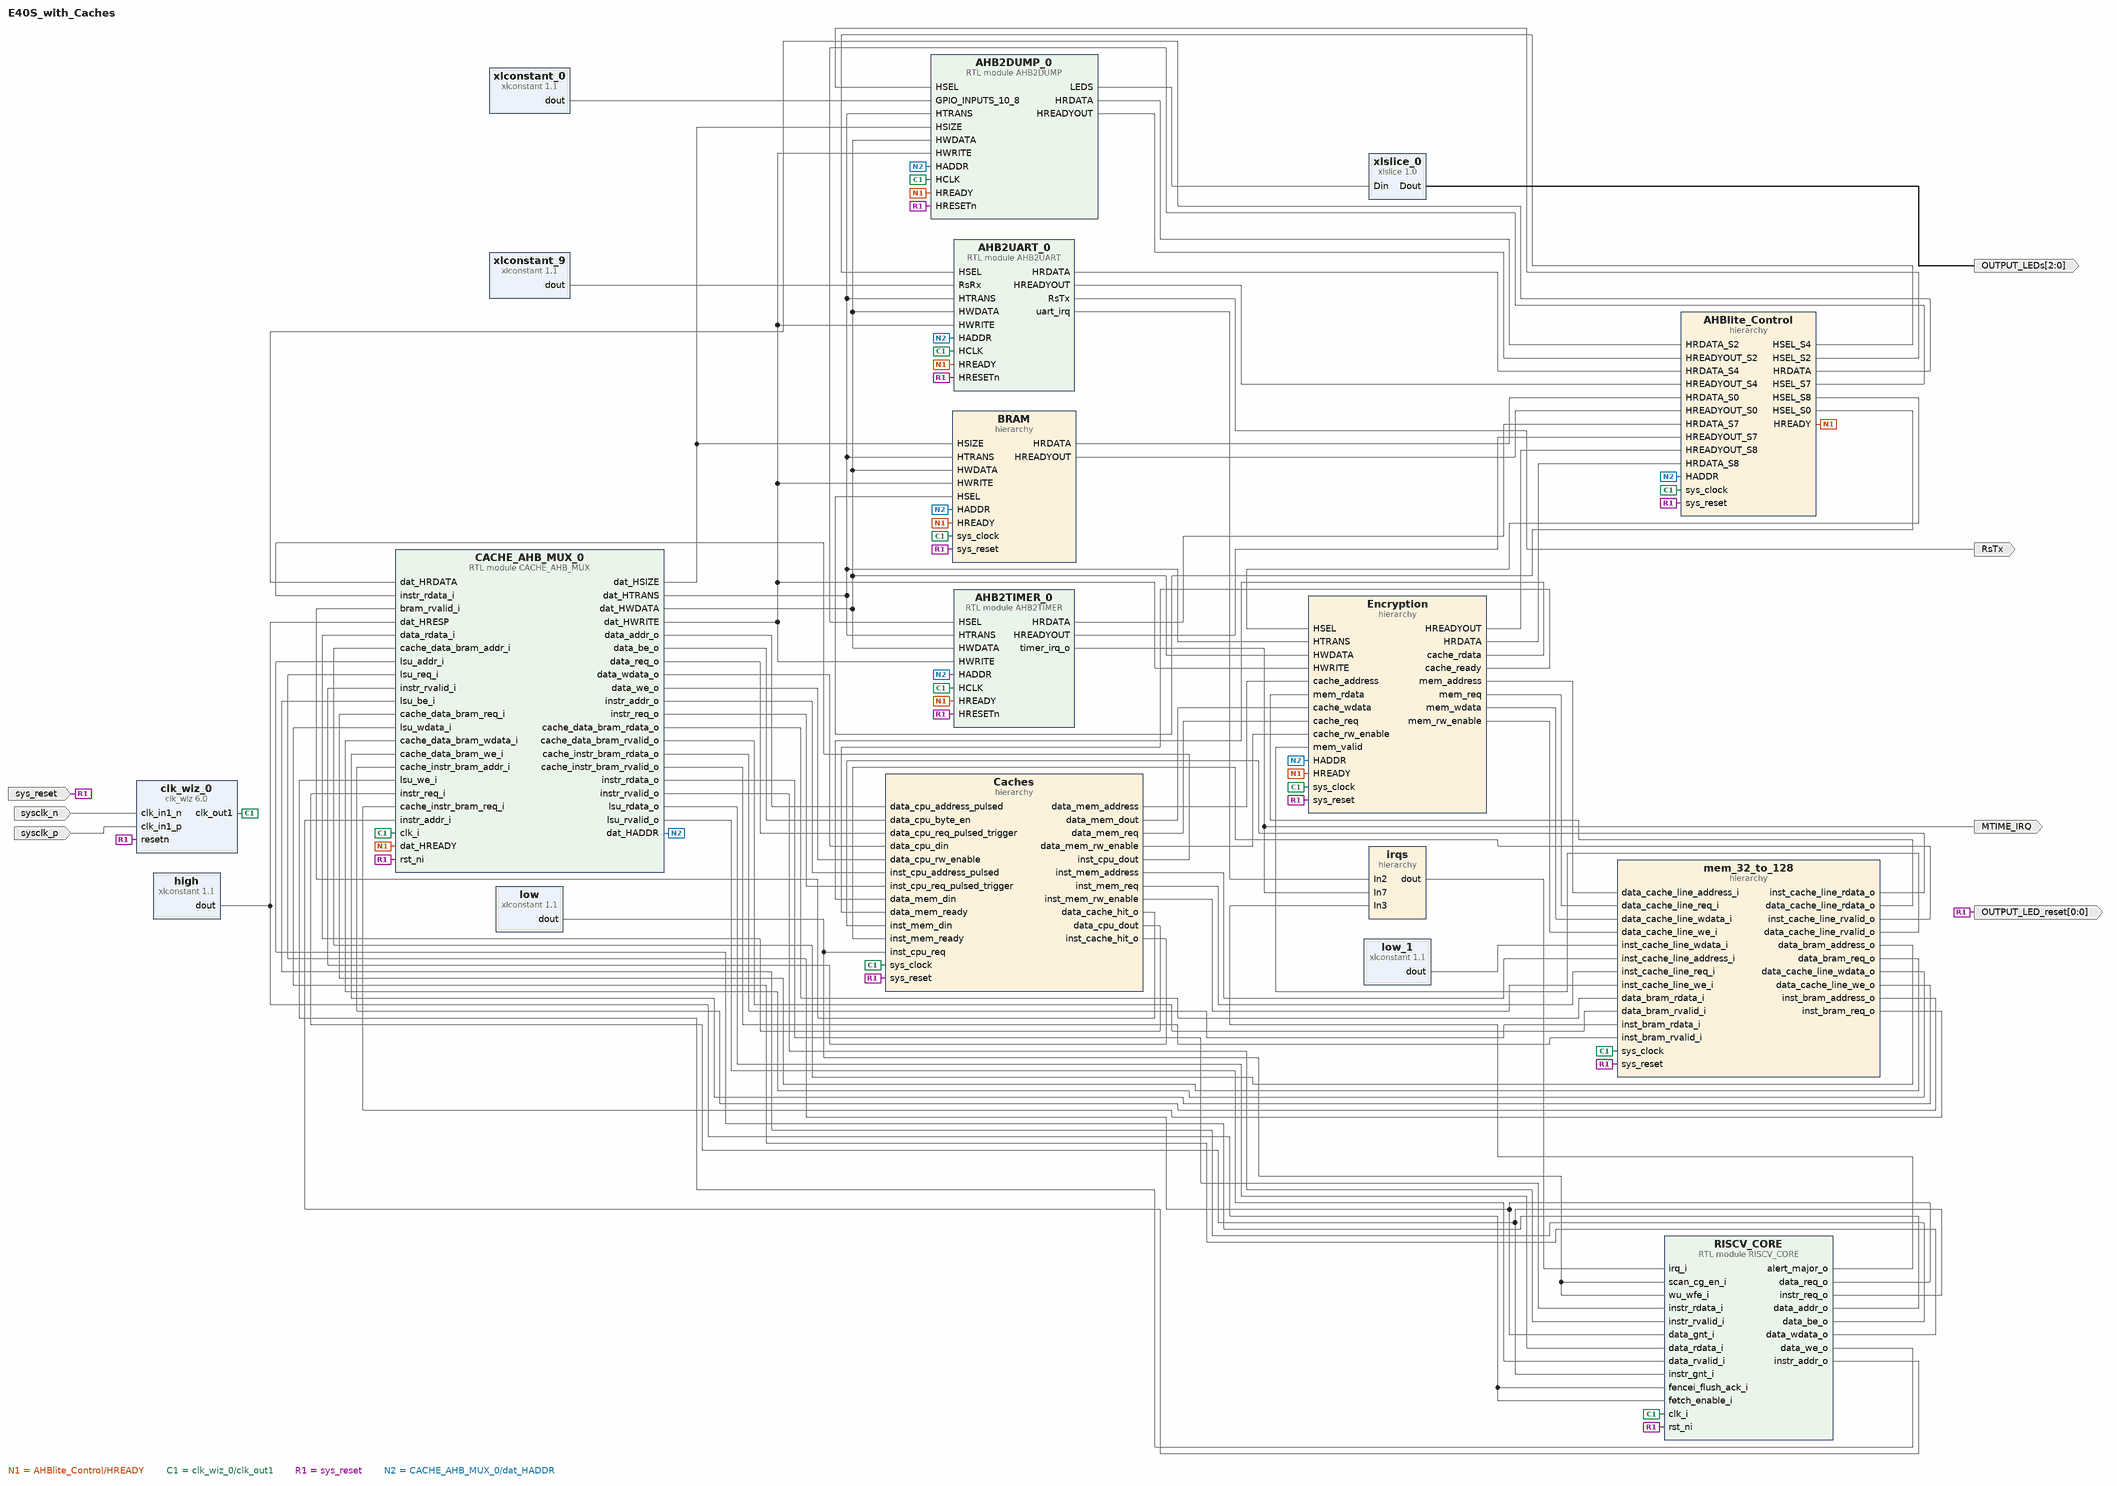
[diagram p0: block diagram of the top level]
# Vivado block design E40S_with_Caches, xc7k325tffg900-2, Vivado 2024.2
create_bd_design E40S_with_Caches

create_bd_port -dir O -from 2 -to 0 OUTPUT_LEDs
create_bd_port -dir O -from 0 -to 0 OUTPUT_LED_reset
create_bd_port -dir I sys_reset
create_bd_port -dir I sysclk_p
create_bd_port -dir I sysclk_n
create_bd_port -dir O RsTx
create_bd_port -dir O MTIME_IRQ

create_bd_cell -type ip -vlnv xilinx.com:ip:xlslice:1.0 xlslice_0
set_property -dict {CONFIG.DIN_FROM 2 CONFIG.DIN_WIDTH 8 CONFIG.DOUT_WIDTH 3} [get_bd_cells xlslice_0]
create_bd_cell -type hier BRAM
create_bd_cell -type hier irqs
create_bd_cell -type hier Caches
create_bd_cell -type hier AHBlite_Control
create_bd_cell -type module -reference AHB2TIMER AHB2TIMER_0
create_bd_cell -type module -reference AHB2UART AHB2UART_0
create_bd_cell -type module -reference CACHE_AHB_MUX CACHE_AHB_MUX_0
set_property -dict {CONFIG.MEMORY_END_ADDRESS 0x80FFFFFF CONFIG.MEMORY_START_ADDRESS 0x80000000} [get_bd_cells CACHE_AHB_MUX_0]
create_bd_cell -type module -reference RISCV_CORE RISCV_CORE
set_property -dict {CONFIG.BOOT_ADDRESS 0x80010000 CONFIG.PMP_NUM_REGIONS 16} [get_bd_cells RISCV_CORE]
create_bd_cell -type hier mem_32_to_128
create_bd_cell -type hier Encryption
create_bd_cell -type module -reference AHB2DUMP AHB2DUMP_0
create_bd_cell -type ip -vlnv xilinx.com:ip:xlconstant:1.1 high
create_bd_cell -type ip -vlnv xilinx.com:ip:xlconstant:1.1 low
set_property -dict {CONFIG.CONST_VAL 0} [get_bd_cells low]
create_bd_cell -type ip -vlnv xilinx.com:ip:xlconstant:1.1 low_1
set_property -dict {CONFIG.CONST_VAL 0 CONFIG.CONST_WIDTH 128} [get_bd_cells low_1]
create_bd_cell -type ip -vlnv xilinx.com:ip:xlconstant:1.1 xlconstant_0
set_property -dict {CONFIG.CONST_WIDTH 3} [get_bd_cells xlconstant_0]
create_bd_cell -type ip -vlnv xilinx.com:ip:xlconstant:1.1 xlconstant_9
set_property -dict {CONFIG.CONST_VAL 0 CONFIG.CONST_WIDTH 1} [get_bd_cells xlconstant_9]
create_bd_cell -type ip -vlnv xilinx.com:ip:clk_wiz:6.0 clk_wiz_0
set_property -dict [list \
  CONFIG.CLKIN1_JITTER_PS 50.0 \
  CONFIG.CLKIN2_JITTER_PS 166.66 \
  CONFIG.CLKOUT1_DRIVES BUFG \
  CONFIG.CLKOUT1_JITTER 155.788 \
  CONFIG.CLKOUT1_PHASE_ERROR 94.329 \
  CONFIG.CLKOUT1_REQUESTED_OUT_FREQ 20.000 \
  CONFIG.CLKOUT2_DRIVES BUFG \
  CONFIG.CLKOUT3_DRIVES BUFG \
  CONFIG.CLKOUT4_DRIVES BUFG \
  CONFIG.CLKOUT5_DRIVES BUFG \
  CONFIG.CLKOUT6_DRIVES BUFG \
  CONFIG.CLKOUT7_DRIVES BUFG \
  CONFIG.FEEDBACK_SOURCE FDBK_AUTO \
  CONFIG.MMCM_BANDWIDTH OPTIMIZED \
  CONFIG.MMCM_CLKFBOUT_MULT_F 4.250 \
  CONFIG.MMCM_CLKIN1_PERIOD 5.000 \
  CONFIG.MMCM_CLKIN2_PERIOD 10.0 \
  CONFIG.MMCM_CLKOUT0_DIVIDE_F 42.500 \
  CONFIG.MMCM_COMPENSATION ZHOLD \
  CONFIG.PRIMITIVE MMCM \
  CONFIG.PRIM_IN_FREQ 200.000 \
  CONFIG.PRIM_SOURCE Differential_clock_capable_pin \
  CONFIG.RESET_PORT resetn \
  CONFIG.RESET_TYPE ACTIVE_LOW \
  CONFIG.SECONDARY_IN_FREQ 100.000 \
  CONFIG.SECONDARY_SOURCE Single_ended_clock_capable_pin \
  CONFIG.USE_INCLK_SWITCHOVER false \
] [get_bd_cells clk_wiz_0]

# ---- hierarchy /BRAM ----
current_bd_instance /BRAM
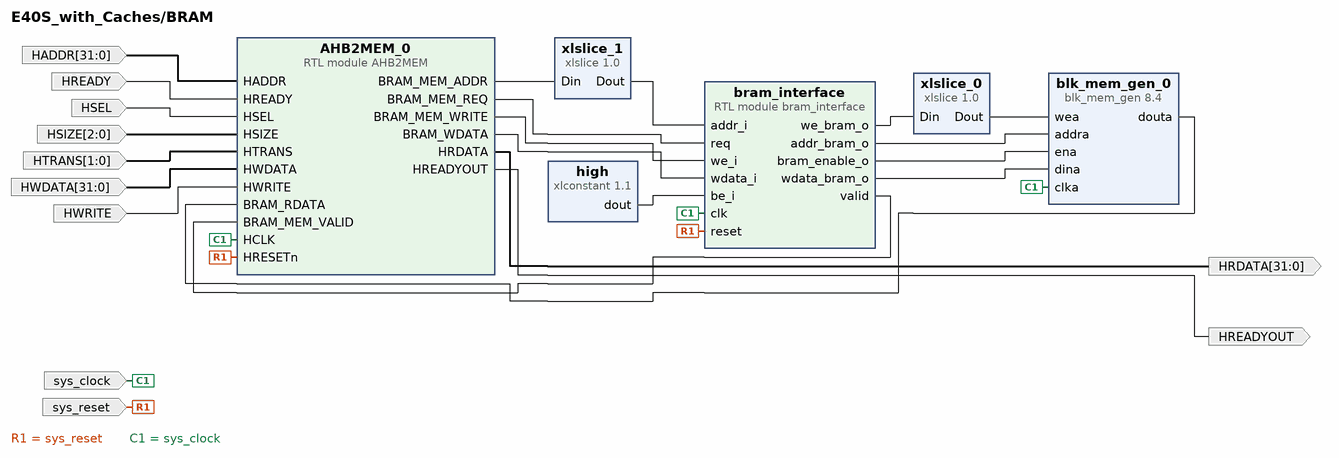
[diagram p1: block diagram inside /BRAM]
create_bd_pin -dir I sys_clock
create_bd_pin -dir I sys_reset
create_bd_pin -dir I HREADY
create_bd_pin -dir I -from 31 -to 0 HADDR
create_bd_pin -dir I HWRITE
create_bd_pin -dir I -from 31 -to 0 HWDATA
create_bd_pin -dir I -from 1 -to 0 HTRANS
create_bd_pin -dir I -from 2 -to 0 HSIZE
create_bd_pin -dir O HREADYOUT
create_bd_pin -dir I HSEL
create_bd_pin -dir O -from 31 -to 0 HRDATA

create_bd_cell -type ip -vlnv xilinx.com:ip:xlslice:1.0 xlslice_1
set_property -dict {CONFIG.DIN_FROM 19 CONFIG.DIN_TO 2 CONFIG.DOUT_WIDTH 18} [get_bd_cells xlslice_1]
create_bd_cell -type module -reference AHB2MEM AHB2MEM_0
create_bd_cell -type module -reference bram_interface bram_interface
set_property -dict {CONFIG.LATENCY_IN_CYCLES 1} [get_bd_cells bram_interface]
create_bd_cell -type ip -vlnv xilinx.com:ip:blk_mem_gen:8.4 blk_mem_gen_0
set_property -dict [list \
  CONFIG.Coe_File /home/clarmann/Documents/coe-files/fpga_demo_2_tasks.coe \
  CONFIG.Enable_32bit_Address false \
  CONFIG.Load_Init_File true \
  CONFIG.Memory_Type Single_Port_RAM \
  CONFIG.Port_B_Clock 0 \
  CONFIG.Port_B_Enable_Rate 0 \
  CONFIG.Port_B_Write_Rate 0 \
  CONFIG.Register_PortA_Output_of_Memory_Primitives true \
  CONFIG.Use_RSTA_Pin false \
  CONFIG.Write_Depth_A 132000 \
  CONFIG.Write_Width_A 32 \
  CONFIG.use_bram_block Stand_Alone \
] [get_bd_cells blk_mem_gen_0]
create_bd_cell -type ip -vlnv xilinx.com:ip:xlconstant:1.1 high
set_property -dict {CONFIG.CONST_VAL 0xf CONFIG.CONST_WIDTH 4} [get_bd_cells high]
create_bd_cell -type ip -vlnv xilinx.com:ip:xlslice:1.0 xlslice_0
set_property -dict {CONFIG.DIN_FROM 0 CONFIG.DIN_WIDTH 4 CONFIG.DOUT_WIDTH 1} [get_bd_cells xlslice_0]

# ---- hierarchy /irqs ----
current_bd_instance /irqs
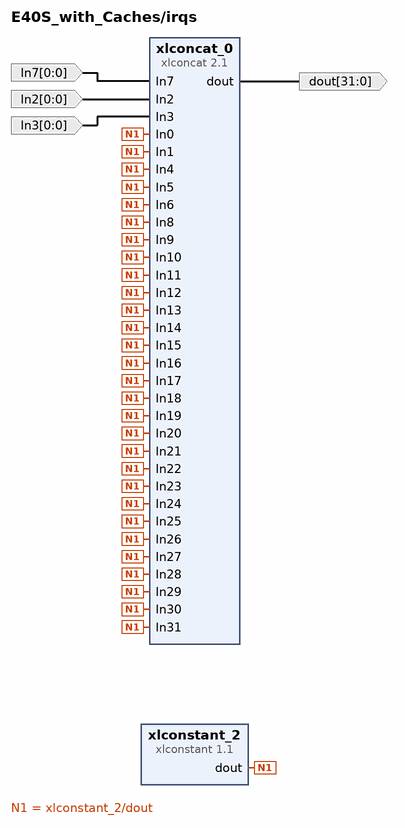
[diagram p2: block diagram inside /irqs]
create_bd_pin -dir I -from 0 -to 0 In2
create_bd_pin -dir I -from 0 -to 0 In7
create_bd_pin -dir O -from 31 -to 0 dout
create_bd_pin -dir I -from 0 -to 0 In3

create_bd_cell -type ip -vlnv xilinx.com:ip:xlconcat:2.1 xlconcat_0
set_property -dict [list \
  CONFIG.IN0_WIDTH 1 \
  CONFIG.IN10_WIDTH 1 \
  CONFIG.IN11_WIDTH 1 \
  CONFIG.IN12_WIDTH 1 \
  CONFIG.IN13_WIDTH 1 \
  CONFIG.IN14_WIDTH 1 \
  CONFIG.IN15_WIDTH 1 \
  CONFIG.IN16_WIDTH 1 \
  CONFIG.IN17_WIDTH 1 \
  CONFIG.IN18_WIDTH 1 \
  CONFIG.IN19_WIDTH 1 \
  CONFIG.IN1_WIDTH 1 \
  CONFIG.IN20_WIDTH 1 \
  CONFIG.IN21_WIDTH 1 \
  CONFIG.IN22_WIDTH 1 \
  CONFIG.IN23_WIDTH 1 \
  CONFIG.IN24_WIDTH 1 \
  CONFIG.IN25_WIDTH 1 \
  CONFIG.IN26_WIDTH 1 \
  CONFIG.IN27_WIDTH 1 \
  CONFIG.IN28_WIDTH 1 \
  CONFIG.IN29_WIDTH 1 \
  CONFIG.IN2_WIDTH 1 \
  CONFIG.IN30_WIDTH 1 \
  CONFIG.IN31_WIDTH 1 \
  CONFIG.IN3_WIDTH 1 \
  CONFIG.IN4_WIDTH 1 \
  CONFIG.IN5_WIDTH 1 \
  CONFIG.IN6_WIDTH 1 \
  CONFIG.IN7_WIDTH 1 \
  CONFIG.IN8_WIDTH 1 \
  CONFIG.IN9_WIDTH 1 \
  CONFIG.NUM_PORTS 32 \
  CONFIG.dout_width 32 \
] [get_bd_cells xlconcat_0]
create_bd_cell -type ip -vlnv xilinx.com:ip:xlconstant:1.1 xlconstant_2
set_property -dict {CONFIG.CONST_VAL 0 CONFIG.CONST_WIDTH 1} [get_bd_cells xlconstant_2]

# ---- hierarchy /Caches ----
current_bd_instance /Caches
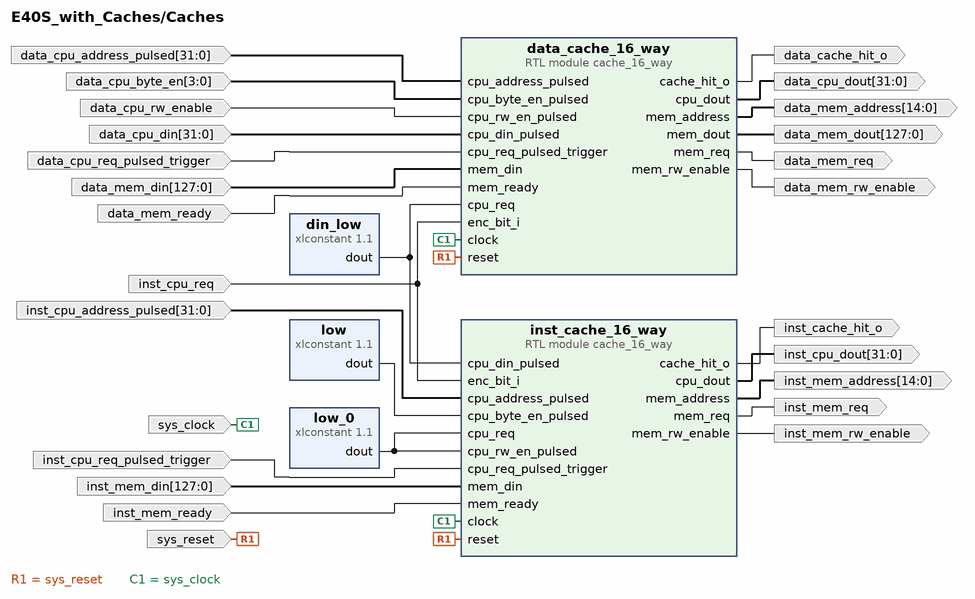
[diagram p3: block diagram inside /Caches]
create_bd_pin -dir I sys_clock
create_bd_pin -dir I sys_reset
create_bd_pin -dir I -from 31 -to 0 inst_cpu_address_pulsed
create_bd_pin -dir O -from 31 -to 0 inst_cpu_dout
create_bd_pin -dir I inst_cpu_req_pulsed_trigger
create_bd_pin -dir I inst_cpu_req
create_bd_pin -dir O inst_cache_hit_o
create_bd_pin -dir I -from 31 -to 0 data_cpu_address_pulsed
create_bd_pin -dir I -from 31 -to 0 data_cpu_din
create_bd_pin -dir O -from 31 -to 0 data_cpu_dout
create_bd_pin -dir I data_cpu_req_pulsed_trigger
create_bd_pin -dir I data_cpu_rw_enable
create_bd_pin -dir O data_cache_hit_o
create_bd_pin -dir I -from 3 -to 0 data_cpu_byte_en
create_bd_pin -dir I -from 127 -to 0 inst_mem_din
create_bd_pin -dir O -from 14 -to 0 inst_mem_address
create_bd_pin -dir O inst_mem_req
create_bd_pin -dir O inst_mem_rw_enable
create_bd_pin -dir I inst_mem_ready
create_bd_pin -dir I -from 127 -to 0 data_mem_din
create_bd_pin -dir O -from 127 -to 0 data_mem_dout
create_bd_pin -dir O -from 14 -to 0 data_mem_address
create_bd_pin -dir O data_mem_req
create_bd_pin -dir O data_mem_rw_enable
create_bd_pin -dir I data_mem_ready

create_bd_cell -type module -reference cache_16_way inst_cache_16_way
set_property -dict {CONFIG.CACHE_SIZE 8 CONFIG.WAYS 4} [get_bd_cells inst_cache_16_way]
create_bd_cell -type module -reference cache_16_way data_cache_16_way
set_property -dict {CONFIG.CACHE_SIZE 8 CONFIG.WAYS 4} [get_bd_cells data_cache_16_way]
create_bd_cell -type ip -vlnv xilinx.com:ip:xlconstant:1.1 din_low
set_property -dict {CONFIG.CONST_VAL 0 CONFIG.CONST_WIDTH 32} [get_bd_cells din_low]
create_bd_cell -type ip -vlnv xilinx.com:ip:xlconstant:1.1 low
set_property -dict {CONFIG.CONST_VAL 0 CONFIG.CONST_WIDTH 4} [get_bd_cells low]
create_bd_cell -type ip -vlnv xilinx.com:ip:xlconstant:1.1 low_0
set_property -dict {CONFIG.CONST_VAL 0 CONFIG.CONST_WIDTH 1} [get_bd_cells low_0]

# ---- hierarchy /AHBlite_Control ----
current_bd_instance /AHBlite_Control
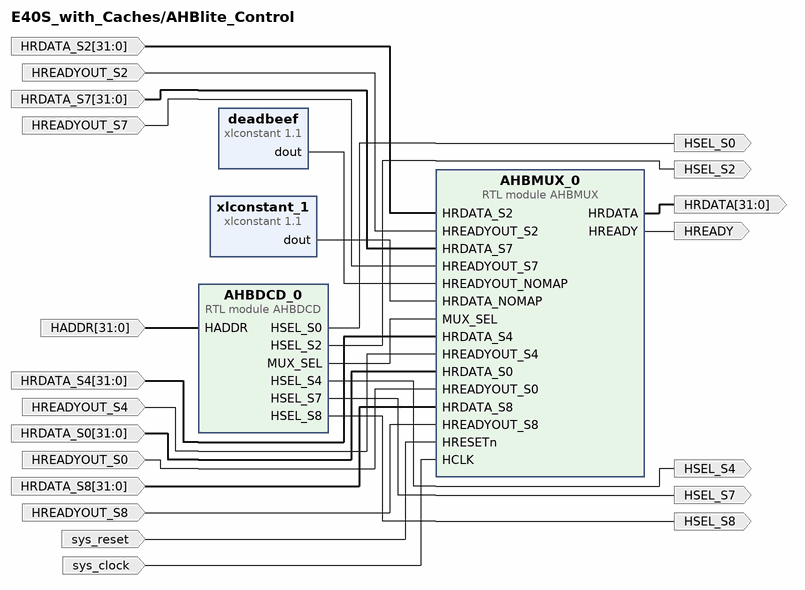
[diagram p4: block diagram inside /AHBlite_Control]
create_bd_pin -dir I sys_clock
create_bd_pin -dir I sys_reset
create_bd_pin -dir I -from 31 -to 0 HRDATA_S0
create_bd_pin -dir I -from 31 -to 0 HRDATA_S2
create_bd_pin -dir I -from 31 -to 0 HRDATA_S4
create_bd_pin -dir I -from 31 -to 0 HRDATA_S7
create_bd_pin -dir I HREADYOUT_S0
create_bd_pin -dir I HREADYOUT_S2
create_bd_pin -dir I HREADYOUT_S4
create_bd_pin -dir I HREADYOUT_S7
create_bd_pin -dir O HREADY
create_bd_pin -dir O -from 31 -to 0 HRDATA
create_bd_pin -dir I -from 31 -to 0 HADDR
create_bd_pin -dir O HSEL_S0
create_bd_pin -dir O HSEL_S2
create_bd_pin -dir O HSEL_S4
create_bd_pin -dir O HSEL_S7
create_bd_pin -dir O HSEL_S8
create_bd_pin -dir I HREADYOUT_S8
create_bd_pin -dir I -from 31 -to 0 HRDATA_S8

create_bd_cell -type module -reference AHBMUX AHBMUX_0
create_bd_cell -type module -reference AHBDCD AHBDCD_0
create_bd_cell -type ip -vlnv xilinx.com:ip:xlconstant:1.1 deadbeef
set_property -dict {CONFIG.CONST_VAL 0xDEADBEEF CONFIG.CONST_WIDTH 32} [get_bd_cells deadbeef]
create_bd_cell -type ip -vlnv xilinx.com:ip:xlconstant:1.1 xlconstant_1
set_property -dict {CONFIG.CONST_VAL 0xDEADBEEF CONFIG.CONST_WIDTH 32} [get_bd_cells xlconstant_1]

# ---- hierarchy /mem_32_to_128 ----
current_bd_instance /mem_32_to_128
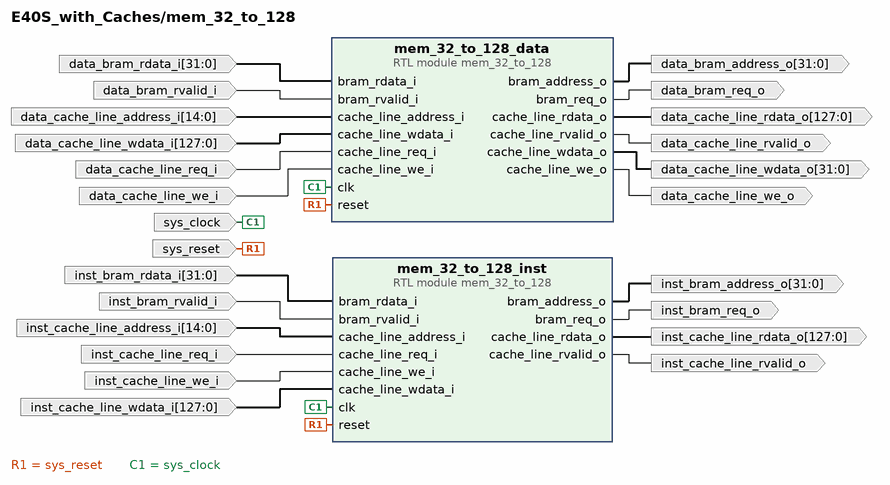
[diagram p5: block diagram inside /mem_32_to_128]
create_bd_pin -dir I sys_clock
create_bd_pin -dir I sys_reset
create_bd_pin -dir I inst_cache_line_req_i
create_bd_pin -dir I -from 14 -to 0 inst_cache_line_address_i
create_bd_pin -dir I inst_cache_line_we_i
create_bd_pin -dir I inst_bram_rvalid_i
create_bd_pin -dir I -from 31 -to 0 inst_bram_rdata_i
create_bd_pin -dir O inst_bram_req_o
create_bd_pin -dir O -from 31 -to 0 inst_bram_address_o
create_bd_pin -dir O -from 127 -to 0 inst_cache_line_rdata_o
create_bd_pin -dir O inst_cache_line_rvalid_o
create_bd_pin -dir I -from 127 -to 0 inst_cache_line_wdata_i
create_bd_pin -dir I data_cache_line_req_i
create_bd_pin -dir I -from 14 -to 0 data_cache_line_address_i
create_bd_pin -dir I data_cache_line_we_i
create_bd_pin -dir I data_bram_rvalid_i
create_bd_pin -dir I -from 31 -to 0 data_bram_rdata_i
create_bd_pin -dir O data_bram_req_o
create_bd_pin -dir O -from 31 -to 0 data_bram_address_o
create_bd_pin -dir O -from 127 -to 0 data_cache_line_rdata_o
create_bd_pin -dir O data_cache_line_rvalid_o
create_bd_pin -dir I -from 127 -to 0 data_cache_line_wdata_i
create_bd_pin -dir O -from 31 -to 0 data_cache_line_wdata_o
create_bd_pin -dir O data_cache_line_we_o

create_bd_cell -type module -reference mem_32_to_128 mem_32_to_128_inst
create_bd_cell -type module -reference mem_32_to_128 mem_32_to_128_data

# ---- hierarchy /Encryption ----
current_bd_instance /Encryption
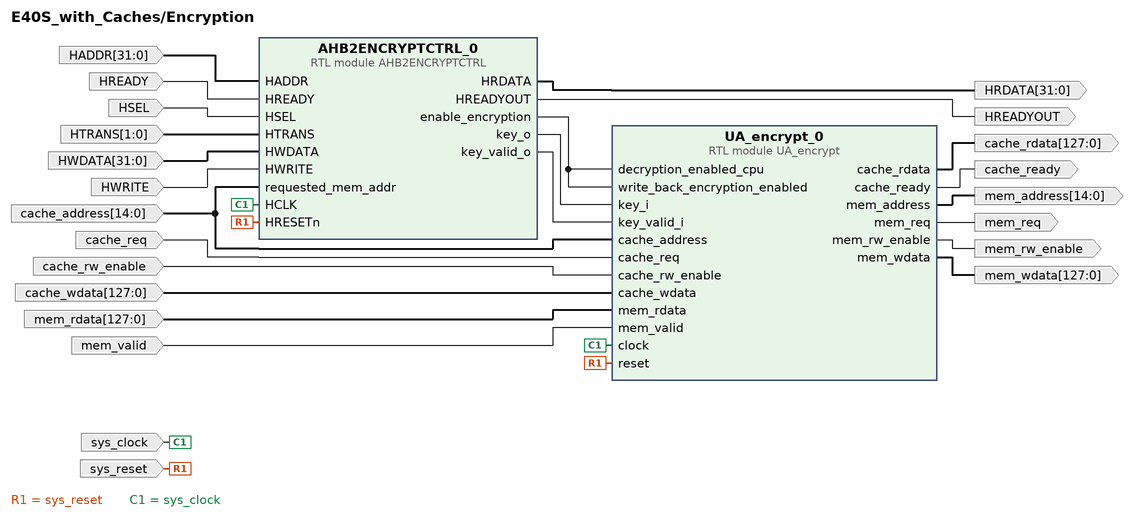
[diagram p6: block diagram inside /Encryption]
create_bd_pin -dir I sys_clock
create_bd_pin -dir I sys_reset
create_bd_pin -dir I -from 14 -to 0 cache_address
create_bd_pin -dir I HSEL
create_bd_pin -dir O HREADYOUT
create_bd_pin -dir I -from 31 -to 0 HADDR
create_bd_pin -dir I -from 1 -to 0 HTRANS
create_bd_pin -dir I HWRITE
create_bd_pin -dir O -from 31 -to 0 HRDATA
create_bd_pin -dir I -from 31 -to 0 HWDATA
create_bd_pin -dir I HREADY
create_bd_pin -dir I mem_valid
create_bd_pin -dir O mem_rw_enable
create_bd_pin -dir O mem_req
create_bd_pin -dir O -from 14 -to 0 mem_address
create_bd_pin -dir O -from 127 -to 0 mem_wdata
create_bd_pin -dir I -from 127 -to 0 mem_rdata
create_bd_pin -dir O cache_ready
create_bd_pin -dir I cache_rw_enable
create_bd_pin -dir I cache_req
create_bd_pin -dir I -from 127 -to 0 cache_wdata
create_bd_pin -dir O -from 127 -to 0 cache_rdata

create_bd_cell -type module -reference AHB2ENCRYPTCTRL AHB2ENCRYPTCTRL_0
create_bd_cell -type module -reference UA_encrypt UA_encrypt_0

# ---- connections ----

current_bd_instance /BRAM
connect_bd_net [get_bd_pins AHB2MEM_0/BRAM_MEM_ADDR] [get_bd_pins xlslice_1/Din]
connect_bd_net [get_bd_pins AHB2MEM_0/BRAM_MEM_REQ] [get_bd_pins bram_interface/req]
connect_bd_net [get_bd_pins AHB2MEM_0/BRAM_MEM_WRITE] [get_bd_pins bram_interface/we_i]
connect_bd_net [get_bd_pins AHB2MEM_0/BRAM_WDATA] [get_bd_pins bram_interface/wdata_i]
connect_bd_net [get_bd_pins AHB2MEM_0/HRDATA] [get_bd_pins HRDATA]
connect_bd_net [get_bd_pins AHB2MEM_0/HREADYOUT] [get_bd_pins HREADYOUT]
connect_bd_net [get_bd_pins HADDR] [get_bd_pins AHB2MEM_0/HADDR]
connect_bd_net [get_bd_pins HREADY] [get_bd_pins AHB2MEM_0/HREADY]
connect_bd_net [get_bd_pins HSEL] [get_bd_pins AHB2MEM_0/HSEL]
connect_bd_net [get_bd_pins HSIZE] [get_bd_pins AHB2MEM_0/HSIZE]
connect_bd_net [get_bd_pins HTRANS] [get_bd_pins AHB2MEM_0/HTRANS]
connect_bd_net [get_bd_pins HWDATA] [get_bd_pins AHB2MEM_0/HWDATA]
connect_bd_net [get_bd_pins HWRITE] [get_bd_pins AHB2MEM_0/HWRITE]
connect_bd_net [get_bd_pins blk_mem_gen_0/douta] [get_bd_pins AHB2MEM_0/BRAM_RDATA]
connect_bd_net -net bram_interface_0_addr_bram_o [get_bd_pins bram_interface/addr_bram_o] [get_bd_pins blk_mem_gen_0/addra]
connect_bd_net -net bram_interface_0_bram_enable_o [get_bd_pins bram_interface/bram_enable_o] [get_bd_pins blk_mem_gen_0/ena]
connect_bd_net [get_bd_pins bram_interface/valid] [get_bd_pins AHB2MEM_0/BRAM_MEM_VALID]
connect_bd_net [get_bd_pins bram_interface/wdata_bram_o] [get_bd_pins blk_mem_gen_0/dina]
connect_bd_net [get_bd_pins bram_interface/we_bram_o] [get_bd_pins xlslice_0/Din]
connect_bd_net -net low1_dout [get_bd_pins high/dout] [get_bd_pins bram_interface/be_i]
connect_bd_net -net proc_sys_reset_1_peripheral_aresetn [get_bd_pins sys_reset] [get_bd_pins AHB2MEM_0/HRESETn] [get_bd_pins bram_interface/reset]
connect_bd_net [get_bd_pins sys_clock] [get_bd_pins blk_mem_gen_0/clka] [get_bd_pins AHB2MEM_0/HCLK] [get_bd_pins bram_interface/clk]
connect_bd_net [get_bd_pins xlslice_0/Dout] [get_bd_pins blk_mem_gen_0/wea]
connect_bd_net [get_bd_pins xlslice_1/Dout] [get_bd_pins bram_interface/addr_i]

current_bd_instance /irqs
connect_bd_net -net AHB2TIMER_0_timer_irq [get_bd_pins In7] [get_bd_pins xlconcat_0/In7]
connect_bd_net -net AHB2UART_0_uart_irq [get_bd_pins In2] [get_bd_pins xlconcat_0/In2]
connect_bd_net -net In3_0_1 [get_bd_pins In3] [get_bd_pins xlconcat_0/In3]
connect_bd_net [get_bd_pins xlconcat_0/dout] [get_bd_pins dout]
connect_bd_net [get_bd_pins xlconstant_2/dout] \
  [get_bd_pins xlconcat_0/In0] [get_bd_pins xlconcat_0/In4] [get_bd_pins xlconcat_0/In5] [get_bd_pins xlconcat_0/In6] \
  [get_bd_pins xlconcat_0/In8] [get_bd_pins xlconcat_0/In9] [get_bd_pins xlconcat_0/In10] [get_bd_pins xlconcat_0/In11] \
  [get_bd_pins xlconcat_0/In12] [get_bd_pins xlconcat_0/In13] [get_bd_pins xlconcat_0/In14] [get_bd_pins xlconcat_0/In15] \
  [get_bd_pins xlconcat_0/In16] [get_bd_pins xlconcat_0/In17] [get_bd_pins xlconcat_0/In18] [get_bd_pins xlconcat_0/In19] \
  [get_bd_pins xlconcat_0/In20] [get_bd_pins xlconcat_0/In21] [get_bd_pins xlconcat_0/In22] [get_bd_pins xlconcat_0/In23] \
  [get_bd_pins xlconcat_0/In24] [get_bd_pins xlconcat_0/In25] [get_bd_pins xlconcat_0/In26] [get_bd_pins xlconcat_0/In27] \
  [get_bd_pins xlconcat_0/In28] [get_bd_pins xlconcat_0/In29] [get_bd_pins xlconcat_0/In30] [get_bd_pins xlconcat_0/In31] \
  [get_bd_pins xlconcat_0/In1]

current_bd_instance /Caches
connect_bd_net -net CACHE_AHB_MUX_0_bram_addr_o [get_bd_pins data_cpu_address_pulsed] [get_bd_pins data_cache_16_way/cpu_address_pulsed]
connect_bd_net -net CACHE_AHB_MUX_0_bram_be_o [get_bd_pins data_cpu_byte_en] [get_bd_pins data_cache_16_way/cpu_byte_en_pulsed]
connect_bd_net -net CACHE_AHB_MUX_0_bram_we_o [get_bd_pins data_cpu_rw_enable] [get_bd_pins data_cache_16_way/cpu_rw_en_pulsed]
connect_bd_net -net CACHE_AHB_MUX_0_instr_addr_o [get_bd_pins inst_cpu_address_pulsed] [get_bd_pins inst_cache_16_way/cpu_address_pulsed]
connect_bd_net -net CACHE_AHB_MUX_0_instr_req_o [get_bd_pins inst_cpu_req_pulsed_trigger] [get_bd_pins inst_cache_16_way/cpu_req_pulsed_trigger]
connect_bd_net -net cache_16_way_0_cpu_dout [get_bd_pins inst_cache_16_way/cpu_dout] [get_bd_pins inst_cpu_dout]
connect_bd_net -net cpu_din1_1 [get_bd_pins data_cpu_din] [get_bd_pins data_cache_16_way/cpu_din_pulsed]
connect_bd_net [get_bd_pins data_cache_16_way/cache_hit_o] [get_bd_pins data_cache_hit_o]
connect_bd_net [get_bd_pins data_cache_16_way/cpu_dout] [get_bd_pins data_cpu_dout]
connect_bd_net [get_bd_pins data_cache_16_way/mem_address] [get_bd_pins data_mem_address]
connect_bd_net [get_bd_pins data_cache_16_way/mem_dout] [get_bd_pins data_mem_dout]
connect_bd_net [get_bd_pins data_cache_16_way/mem_req] [get_bd_pins data_mem_req]
connect_bd_net [get_bd_pins data_cache_16_way/mem_rw_enable] [get_bd_pins data_mem_rw_enable]
connect_bd_net [get_bd_pins data_cpu_req_pulsed_trigger] [get_bd_pins data_cache_16_way/cpu_req_pulsed_trigger]
connect_bd_net [get_bd_pins data_mem_din] [get_bd_pins data_cache_16_way/mem_din]
connect_bd_net -net high1_dout [get_bd_pins low/dout] [get_bd_pins inst_cache_16_way/cpu_byte_en_pulsed]
connect_bd_net -net high2_dout [get_bd_pins din_low/dout] [get_bd_pins inst_cache_16_way/cpu_din_pulsed] [get_bd_pins data_cache_16_way/cpu_req]
connect_bd_net -net inst_cache_16_way_cpu_ready [get_bd_pins inst_cache_16_way/cache_hit_o] [get_bd_pins inst_cache_hit_o]
connect_bd_net [get_bd_pins inst_cache_16_way/mem_address] [get_bd_pins inst_mem_address]
connect_bd_net [get_bd_pins inst_cache_16_way/mem_req] [get_bd_pins inst_mem_req]
connect_bd_net [get_bd_pins inst_cache_16_way/mem_rw_enable] [get_bd_pins inst_mem_rw_enable]
connect_bd_net [get_bd_pins inst_mem_din] [get_bd_pins inst_cache_16_way/mem_din]
connect_bd_net [get_bd_pins low_0/dout] [get_bd_pins inst_cache_16_way/cpu_rw_en_pulsed] [get_bd_pins inst_cache_16_way/cpu_req]
connect_bd_net -net mem_ready1_1 [get_bd_pins data_mem_ready] [get_bd_pins data_cache_16_way/mem_ready]
connect_bd_net -net mem_ready_1 [get_bd_pins inst_mem_ready] [get_bd_pins inst_cache_16_way/mem_ready]
connect_bd_net -net proc_sys_reset_1_peripheral_aresetn [get_bd_pins sys_reset] \
  [get_bd_pins inst_cache_16_way/reset] [get_bd_pins data_cache_16_way/reset]
connect_bd_net [get_bd_pins sys_clock] [get_bd_pins inst_cache_16_way/clock] [get_bd_pins data_cache_16_way/clock]
connect_bd_net -net xlconstant_4_dout [get_bd_pins inst_cpu_req] [get_bd_pins inst_cache_16_way/enc_bit_i] [get_bd_pins data_cache_16_way/enc_bit_i]

current_bd_instance /AHBlite_Control
connect_bd_net -net AHB2DUMP_0_HRDATA [get_bd_pins HRDATA_S2] [get_bd_pins AHBMUX_0/HRDATA_S2]
connect_bd_net -net AHB2DUMP_0_HREADYOUT [get_bd_pins HREADYOUT_S2] [get_bd_pins AHBMUX_0/HREADYOUT_S2]
connect_bd_net -net AHB2TIMER_0_HRDATA [get_bd_pins HRDATA_S7] [get_bd_pins AHBMUX_0/HRDATA_S7]
connect_bd_net -net AHB2TIMER_0_HREADYOUT [get_bd_pins HREADYOUT_S7] [get_bd_pins AHBMUX_0/HREADYOUT_S7]
connect_bd_net -net AHB2UART_0_HRDATA [get_bd_pins HRDATA_S4] [get_bd_pins AHBMUX_0/HRDATA_S4]
connect_bd_net -net AHB2UART_0_HREADYOUT [get_bd_pins HREADYOUT_S4] [get_bd_pins AHBMUX_0/HREADYOUT_S4]
connect_bd_net [get_bd_pins AHBDCD_0/HSEL_S0] [get_bd_pins HSEL_S0]
connect_bd_net [get_bd_pins AHBDCD_0/HSEL_S2] [get_bd_pins HSEL_S2]
connect_bd_net [get_bd_pins AHBDCD_0/HSEL_S4] [get_bd_pins HSEL_S4]
connect_bd_net [get_bd_pins AHBDCD_0/HSEL_S7] [get_bd_pins HSEL_S7]
connect_bd_net [get_bd_pins AHBDCD_0/HSEL_S8] [get_bd_pins HSEL_S8]
connect_bd_net [get_bd_pins AHBDCD_0/MUX_SEL] [get_bd_pins AHBMUX_0/MUX_SEL]
connect_bd_net [get_bd_pins AHBMUX_0/HRDATA] [get_bd_pins HRDATA]
connect_bd_net -net AHB_CACHE_1_HREADYOUT [get_bd_pins AHBMUX_0/HREADY] [get_bd_pins HREADY]
connect_bd_net -net BRAM_HRDATA [get_bd_pins HRDATA_S0] [get_bd_pins AHBMUX_0/HRDATA_S0]
connect_bd_net -net BRAM_HREADYOUT [get_bd_pins HREADYOUT_S0] [get_bd_pins AHBMUX_0/HREADYOUT_S0]
connect_bd_net -net HRDATA_S8_1 [get_bd_pins HRDATA_S8] [get_bd_pins AHBMUX_0/HRDATA_S8]
connect_bd_net -net HREADYOUT_S8_1 [get_bd_pins HREADYOUT_S8] [get_bd_pins AHBMUX_0/HREADYOUT_S8]
connect_bd_net [get_bd_pins deadbeef/dout] [get_bd_pins AHBMUX_0/HREADYOUT_NOMAP]
connect_bd_net -net proc_sys_reset_1_peripheral_aresetn [get_bd_pins sys_reset] [get_bd_pins AHBMUX_0/HRESETn]
connect_bd_net -net riscv_top_ahb3lite_0_dat_HADDR [get_bd_pins HADDR] [get_bd_pins AHBDCD_0/HADDR]
connect_bd_net [get_bd_pins sys_clock] [get_bd_pins AHBMUX_0/HCLK]
connect_bd_net [get_bd_pins xlconstant_1/dout] [get_bd_pins AHBMUX_0/HRDATA_NOMAP]

current_bd_instance /mem_32_to_128
connect_bd_net -net CACHE_AHB_MUX_0_cache_data_bram_rdata_o [get_bd_pins data_bram_rdata_i] [get_bd_pins mem_32_to_128_data/bram_rdata_i]
connect_bd_net -net CACHE_AHB_MUX_0_cache_data_bram_rvalid_o [get_bd_pins data_bram_rvalid_i] [get_bd_pins mem_32_to_128_data/bram_rvalid_i]
connect_bd_net -net CACHE_AHB_MUX_0_cache_instr_bram_rdata_o [get_bd_pins inst_bram_rdata_i] [get_bd_pins mem_32_to_128_inst/bram_rdata_i]
connect_bd_net -net CACHE_AHB_MUX_0_cache_instr_bram_rvalid_o [get_bd_pins inst_bram_rvalid_i] [get_bd_pins mem_32_to_128_inst/bram_rvalid_i]
connect_bd_net -net Caches_mem_address [get_bd_pins inst_cache_line_address_i] [get_bd_pins mem_32_to_128_inst/cache_line_address_i]
connect_bd_net -net Caches_mem_address1 [get_bd_pins data_cache_line_address_i] [get_bd_pins mem_32_to_128_data/cache_line_address_i]
connect_bd_net -net Caches_mem_dout [get_bd_pins data_cache_line_wdata_i] [get_bd_pins mem_32_to_128_data/cache_line_wdata_i]
connect_bd_net -net Caches_mem_req [get_bd_pins inst_cache_line_req_i] [get_bd_pins mem_32_to_128_inst/cache_line_req_i]
connect_bd_net -net Caches_mem_req1 [get_bd_pins data_cache_line_req_i] [get_bd_pins mem_32_to_128_data/cache_line_req_i]
connect_bd_net -net Caches_mem_rw_enable [get_bd_pins inst_cache_line_we_i] [get_bd_pins mem_32_to_128_inst/cache_line_we_i]
connect_bd_net -net Caches_mem_rw_enable1 [get_bd_pins data_cache_line_we_i] [get_bd_pins mem_32_to_128_data/cache_line_we_i]
connect_bd_net -net low_1_dout [get_bd_pins inst_cache_line_wdata_i] [get_bd_pins mem_32_to_128_inst/cache_line_wdata_i]
connect_bd_net [get_bd_pins mem_32_to_128_data/bram_address_o] [get_bd_pins data_bram_address_o]
connect_bd_net [get_bd_pins mem_32_to_128_data/bram_req_o] [get_bd_pins data_bram_req_o]
connect_bd_net [get_bd_pins mem_32_to_128_data/cache_line_rdata_o] [get_bd_pins data_cache_line_rdata_o]
connect_bd_net [get_bd_pins mem_32_to_128_data/cache_line_rvalid_o] [get_bd_pins data_cache_line_rvalid_o]
connect_bd_net [get_bd_pins mem_32_to_128_data/cache_line_wdata_o] [get_bd_pins data_cache_line_wdata_o]
connect_bd_net [get_bd_pins mem_32_to_128_data/cache_line_we_o] [get_bd_pins data_cache_line_we_o]
connect_bd_net [get_bd_pins mem_32_to_128_inst/bram_address_o] [get_bd_pins inst_bram_address_o]
connect_bd_net [get_bd_pins mem_32_to_128_inst/bram_req_o] [get_bd_pins inst_bram_req_o]
connect_bd_net [get_bd_pins mem_32_to_128_inst/cache_line_rdata_o] [get_bd_pins inst_cache_line_rdata_o]
connect_bd_net [get_bd_pins mem_32_to_128_inst/cache_line_rvalid_o] [get_bd_pins inst_cache_line_rvalid_o]
connect_bd_net -net proc_sys_reset_1_peripheral_aresetn [get_bd_pins sys_reset] \
  [get_bd_pins mem_32_to_128_inst/reset] [get_bd_pins mem_32_to_128_data/reset]
connect_bd_net [get_bd_pins sys_clock] [get_bd_pins mem_32_to_128_inst/clk] [get_bd_pins mem_32_to_128_data/clk]

current_bd_instance /Encryption
connect_bd_net [get_bd_pins AHB2ENCRYPTCTRL_0/HRDATA] [get_bd_pins HRDATA]
connect_bd_net [get_bd_pins AHB2ENCRYPTCTRL_0/HREADYOUT] [get_bd_pins HREADYOUT]
connect_bd_net [get_bd_pins AHB2ENCRYPTCTRL_0/enable_encryption] \
  [get_bd_pins UA_encrypt_0/decryption_enabled_cpu] [get_bd_pins UA_encrypt_0/write_back_encryption_enabled]
connect_bd_net [get_bd_pins AHB2ENCRYPTCTRL_0/key_o] [get_bd_pins UA_encrypt_0/key_i]
connect_bd_net [get_bd_pins AHB2ENCRYPTCTRL_0/key_valid_o] [get_bd_pins UA_encrypt_0/key_valid_i]
connect_bd_net [get_bd_pins HADDR] [get_bd_pins AHB2ENCRYPTCTRL_0/HADDR]
connect_bd_net [get_bd_pins HREADY] [get_bd_pins AHB2ENCRYPTCTRL_0/HREADY]
connect_bd_net [get_bd_pins HSEL] [get_bd_pins AHB2ENCRYPTCTRL_0/HSEL]
connect_bd_net [get_bd_pins HTRANS] [get_bd_pins AHB2ENCRYPTCTRL_0/HTRANS]
connect_bd_net [get_bd_pins HWDATA] [get_bd_pins AHB2ENCRYPTCTRL_0/HWDATA]
connect_bd_net [get_bd_pins HWRITE] [get_bd_pins AHB2ENCRYPTCTRL_0/HWRITE]
connect_bd_net [get_bd_pins UA_encrypt_0/cache_rdata] [get_bd_pins cache_rdata]
connect_bd_net [get_bd_pins UA_encrypt_0/cache_ready] [get_bd_pins cache_ready]
connect_bd_net [get_bd_pins UA_encrypt_0/mem_address] [get_bd_pins mem_address]
connect_bd_net [get_bd_pins UA_encrypt_0/mem_req] [get_bd_pins mem_req]
connect_bd_net [get_bd_pins UA_encrypt_0/mem_rw_enable] [get_bd_pins mem_rw_enable]
connect_bd_net [get_bd_pins UA_encrypt_0/mem_wdata] [get_bd_pins mem_wdata]
connect_bd_net [get_bd_pins cache_address] [get_bd_pins AHB2ENCRYPTCTRL_0/requested_mem_addr] [get_bd_pins UA_encrypt_0/cache_address]
connect_bd_net [get_bd_pins cache_req] [get_bd_pins UA_encrypt_0/cache_req]
connect_bd_net [get_bd_pins cache_rw_enable] [get_bd_pins UA_encrypt_0/cache_rw_enable]
connect_bd_net [get_bd_pins cache_wdata] [get_bd_pins UA_encrypt_0/cache_wdata]
connect_bd_net [get_bd_pins mem_rdata] [get_bd_pins UA_encrypt_0/mem_rdata]
connect_bd_net [get_bd_pins mem_valid] [get_bd_pins UA_encrypt_0/mem_valid]
connect_bd_net -net proc_sys_reset_1_peripheral_aresetn [get_bd_pins sys_reset] \
  [get_bd_pins AHB2ENCRYPTCTRL_0/HRESETn] [get_bd_pins UA_encrypt_0/reset]
connect_bd_net [get_bd_pins sys_clock] [get_bd_pins AHB2ENCRYPTCTRL_0/HCLK] [get_bd_pins UA_encrypt_0/clock]

current_bd_instance /
connect_bd_net [get_bd_pins AHB2DUMP_0/HRDATA] [get_bd_pins AHBlite_Control/HRDATA_S2]
connect_bd_net [get_bd_pins AHB2DUMP_0/HREADYOUT] [get_bd_pins AHBlite_Control/HREADYOUT_S2]
connect_bd_net [get_bd_pins AHB2DUMP_0/LEDS] [get_bd_pins xlslice_0/Din]
connect_bd_net [get_bd_pins AHB2TIMER_0/HRDATA] [get_bd_pins AHBlite_Control/HRDATA_S7]
connect_bd_net [get_bd_pins AHB2TIMER_0/HREADYOUT] [get_bd_pins AHBlite_Control/HREADYOUT_S7]
connect_bd_net -net AHB2TIMER_0_timer_irq [get_bd_pins AHB2TIMER_0/timer_irq_o] [get_bd_pins irqs/In7] [get_bd_ports MTIME_IRQ]
connect_bd_net [get_bd_pins AHB2UART_0/HRDATA] [get_bd_pins AHBlite_Control/HRDATA_S4]
connect_bd_net [get_bd_pins AHB2UART_0/HREADYOUT] [get_bd_pins AHBlite_Control/HREADYOUT_S4]
connect_bd_net [get_bd_pins AHB2UART_0/RsTx] [get_bd_ports RsTx]
connect_bd_net [get_bd_pins AHB2UART_0/uart_irq] [get_bd_pins irqs/In2]
connect_bd_net -net AHBDCD_0_HSEL_S0 [get_bd_pins AHBlite_Control/HSEL_S0] [get_bd_pins BRAM/HSEL]
connect_bd_net -net AHBDCD_0_HSEL_S2 [get_bd_pins AHBlite_Control/HSEL_S2] [get_bd_pins AHB2DUMP_0/HSEL]
connect_bd_net -net AHBDCD_0_HSEL_S4 [get_bd_pins AHBlite_Control/HSEL_S4] [get_bd_pins AHB2UART_0/HSEL]
connect_bd_net -net AHBDCD_0_HSEL_S7 [get_bd_pins AHBlite_Control/HSEL_S7] [get_bd_pins AHB2TIMER_0/HSEL]
connect_bd_net -net AHBMUX_0_HRDATA [get_bd_pins AHBlite_Control/HRDATA] [get_bd_pins CACHE_AHB_MUX_0/dat_HRDATA]
connect_bd_net -net AHB_CACHE_1_HREADYOUT [get_bd_pins AHBlite_Control/HREADY] \
  [get_bd_pins BRAM/HREADY] [get_bd_pins Encryption/HREADY] [get_bd_pins CACHE_AHB_MUX_0/dat_HREADY] \
  [get_bd_pins AHB2DUMP_0/HREADY] [get_bd_pins AHB2TIMER_0/HREADY] [get_bd_pins AHB2UART_0/HREADY]
connect_bd_net [get_bd_pins AHBlite_Control/HSEL_S8] [get_bd_pins Encryption/HSEL]
connect_bd_net -net BRAM_AHB_MUX_0_dat_HSIZE [get_bd_pins CACHE_AHB_MUX_0/dat_HSIZE] [get_bd_pins BRAM/HSIZE] [get_bd_pins AHB2DUMP_0/HSIZE]
connect_bd_net [get_bd_pins BRAM/HRDATA] [get_bd_pins AHBlite_Control/HRDATA_S0]
connect_bd_net [get_bd_pins BRAM/HREADYOUT] [get_bd_pins AHBlite_Control/HREADYOUT_S0]
connect_bd_net -net CACHE_AHB_MUX_0_bram_addr_o [get_bd_pins CACHE_AHB_MUX_0/data_addr_o] [get_bd_pins Caches/data_cpu_address_pulsed]
connect_bd_net -net CACHE_AHB_MUX_0_bram_be_o [get_bd_pins CACHE_AHB_MUX_0/data_be_o] [get_bd_pins Caches/data_cpu_byte_en]
connect_bd_net -net CACHE_AHB_MUX_0_bram_req_o [get_bd_pins CACHE_AHB_MUX_0/data_req_o] [get_bd_pins Caches/data_cpu_req_pulsed_trigger]
connect_bd_net -net CACHE_AHB_MUX_0_bram_wdata_o [get_bd_pins CACHE_AHB_MUX_0/data_wdata_o] [get_bd_pins Caches/data_cpu_din]
connect_bd_net -net CACHE_AHB_MUX_0_bram_we_o [get_bd_pins CACHE_AHB_MUX_0/data_we_o] [get_bd_pins Caches/data_cpu_rw_enable]
connect_bd_net [get_bd_pins CACHE_AHB_MUX_0/cache_data_bram_rdata_o] [get_bd_pins mem_32_to_128/data_bram_rdata_i]
connect_bd_net [get_bd_pins CACHE_AHB_MUX_0/cache_data_bram_rvalid_o] [get_bd_pins mem_32_to_128/data_bram_rvalid_i]
connect_bd_net [get_bd_pins CACHE_AHB_MUX_0/cache_instr_bram_rdata_o] [get_bd_pins mem_32_to_128/inst_bram_rdata_i]
connect_bd_net [get_bd_pins CACHE_AHB_MUX_0/cache_instr_bram_rvalid_o] [get_bd_pins mem_32_to_128/inst_bram_rvalid_i]
connect_bd_net [get_bd_pins CACHE_AHB_MUX_0/instr_addr_o] [get_bd_pins Caches/inst_cpu_address_pulsed]
connect_bd_net [get_bd_pins CACHE_AHB_MUX_0/instr_rdata_o] [get_bd_pins RISCV_CORE/instr_rdata_i]
connect_bd_net [get_bd_pins CACHE_AHB_MUX_0/instr_req_o] [get_bd_pins Caches/inst_cpu_req_pulsed_trigger]
connect_bd_net [get_bd_pins CACHE_AHB_MUX_0/instr_rvalid_o] [get_bd_pins RISCV_CORE/instr_rvalid_i]
connect_bd_net [get_bd_pins CACHE_AHB_MUX_0/lsu_rdata_o] [get_bd_pins RISCV_CORE/data_rdata_i]
connect_bd_net [get_bd_pins CACHE_AHB_MUX_0/lsu_rvalid_o] [get_bd_pins RISCV_CORE/data_rvalid_i]
connect_bd_net [get_bd_pins Caches/data_mem_address] [get_bd_pins Encryption/cache_address]
connect_bd_net [get_bd_pins Caches/data_mem_dout] [get_bd_pins Encryption/cache_wdata]
connect_bd_net [get_bd_pins Caches/data_mem_req] [get_bd_pins Encryption/cache_req]
connect_bd_net [get_bd_pins Caches/data_mem_rw_enable] [get_bd_pins Encryption/cache_rw_enable]
connect_bd_net -net Caches_mem_address [get_bd_pins Caches/inst_mem_address] [get_bd_pins mem_32_to_128/inst_cache_line_address_i]
connect_bd_net -net Caches_mem_req [get_bd_pins Caches/inst_mem_req] [get_bd_pins mem_32_to_128/inst_cache_line_req_i]
connect_bd_net -net Caches_mem_rw_enable [get_bd_pins Caches/inst_mem_rw_enable] [get_bd_pins mem_32_to_128/inst_cache_line_we_i]
connect_bd_net [get_bd_pins Encryption/HREADYOUT] [get_bd_pins AHBlite_Control/HREADYOUT_S8]
connect_bd_net -net HRDATA_S8_1 [get_bd_pins Encryption/HRDATA] [get_bd_pins AHBlite_Control/HRDATA_S8]
connect_bd_net [get_bd_pins RISCV_CORE/alert_major_o] [get_bd_pins irqs/In3]
connect_bd_net [get_bd_pins RISCV_CORE/data_addr_o] [get_bd_pins CACHE_AHB_MUX_0/lsu_addr_i]
connect_bd_net [get_bd_pins RISCV_CORE/data_be_o] [get_bd_pins CACHE_AHB_MUX_0/lsu_be_i]
connect_bd_net [get_bd_pins RISCV_CORE/data_req_o] [get_bd_pins CACHE_AHB_MUX_0/lsu_req_i] [get_bd_pins RISCV_CORE/data_gnt_i]
connect_bd_net [get_bd_pins RISCV_CORE/data_wdata_o] [get_bd_pins CACHE_AHB_MUX_0/lsu_wdata_i]
connect_bd_net [get_bd_pins RISCV_CORE/data_we_o] [get_bd_pins CACHE_AHB_MUX_0/lsu_we_i]
connect_bd_net [get_bd_pins RISCV_CORE/instr_addr_o] [get_bd_pins CACHE_AHB_MUX_0/instr_addr_i]
connect_bd_net [get_bd_pins RISCV_CORE/instr_req_o] [get_bd_pins CACHE_AHB_MUX_0/instr_req_i] [get_bd_pins RISCV_CORE/instr_gnt_i]
connect_bd_net -net cache_16_way_0_cpu_dout [get_bd_pins Caches/inst_cpu_dout] [get_bd_pins CACHE_AHB_MUX_0/instr_rdata_i]
connect_bd_net -net data_cache_16_way_cache_hit_o [get_bd_pins Caches/data_cache_hit_o] [get_bd_pins CACHE_AHB_MUX_0/bram_rvalid_i]
connect_bd_net -net data_cache_16_way_cpu_dout [get_bd_pins Caches/data_cpu_dout] [get_bd_pins CACHE_AHB_MUX_0/data_rdata_i]
connect_bd_net -net data_cache_line_address_i_1 [get_bd_pins Encryption/mem_address] [get_bd_pins mem_32_to_128/data_cache_line_address_i]
connect_bd_net -net data_cache_line_req_i_1 [get_bd_pins Encryption/mem_req] [get_bd_pins mem_32_to_128/data_cache_line_req_i]
connect_bd_net -net data_cache_line_wdata_i_1 [get_bd_pins Encryption/mem_wdata] [get_bd_pins mem_32_to_128/data_cache_line_wdata_i]
connect_bd_net -net data_cache_line_we_i_1 [get_bd_pins Encryption/mem_rw_enable] [get_bd_pins mem_32_to_128/data_cache_line_we_i]
connect_bd_net -net data_mem_din_1 [get_bd_pins Encryption/cache_rdata] [get_bd_pins Caches/data_mem_din]
connect_bd_net -net data_mem_ready_1 [get_bd_pins Encryption/cache_ready] [get_bd_pins Caches/data_mem_ready]
connect_bd_net -net inst_cache_16_way_cpu_ready [get_bd_pins Caches/inst_cache_hit_o] [get_bd_pins CACHE_AHB_MUX_0/instr_rvalid_i]
connect_bd_net [get_bd_pins low_1/dout] [get_bd_pins mem_32_to_128/inst_cache_line_wdata_i]
connect_bd_net [get_bd_pins mem_32_to_128/data_bram_address_o] [get_bd_pins CACHE_AHB_MUX_0/cache_data_bram_addr_i]
connect_bd_net [get_bd_pins mem_32_to_128/data_bram_req_o] [get_bd_pins CACHE_AHB_MUX_0/cache_data_bram_req_i]
connect_bd_net [get_bd_pins mem_32_to_128/data_cache_line_rdata_o] [get_bd_pins Encryption/mem_rdata]
connect_bd_net [get_bd_pins mem_32_to_128/data_cache_line_rvalid_o] [get_bd_pins Encryption/mem_valid]
connect_bd_net [get_bd_pins mem_32_to_128/data_cache_line_wdata_o] [get_bd_pins CACHE_AHB_MUX_0/cache_data_bram_wdata_i]
connect_bd_net [get_bd_pins mem_32_to_128/data_cache_line_we_o] [get_bd_pins CACHE_AHB_MUX_0/cache_data_bram_we_i]
connect_bd_net [get_bd_pins mem_32_to_128/inst_bram_address_o] [get_bd_pins CACHE_AHB_MUX_0/cache_instr_bram_addr_i]
connect_bd_net [get_bd_pins mem_32_to_128/inst_bram_req_o] [get_bd_pins CACHE_AHB_MUX_0/cache_instr_bram_req_i]
connect_bd_net [get_bd_pins mem_32_to_128/inst_cache_line_rdata_o] [get_bd_pins Caches/inst_mem_din]
connect_bd_net [get_bd_pins mem_32_to_128/inst_cache_line_rvalid_o] [get_bd_pins Caches/inst_mem_ready]
connect_bd_net -net microblaze_0_Clk [get_bd_pins clk_wiz_0/clk_out1] \
  [get_bd_pins BRAM/sys_clock] [get_bd_pins Caches/sys_clock] [get_bd_pins AHBlite_Control/sys_clock] \
  [get_bd_pins mem_32_to_128/sys_clock] [get_bd_pins Encryption/sys_clock] [get_bd_pins CACHE_AHB_MUX_0/clk_i] \
  [get_bd_pins AHB2DUMP_0/HCLK] [get_bd_pins RISCV_CORE/clk_i] [get_bd_pins AHB2TIMER_0/HCLK] [get_bd_pins AHB2UART_0/HCLK]
connect_bd_net -net proc_sys_reset_1_peripheral_aresetn [get_bd_ports sys_reset] \
  [get_bd_ports OUTPUT_LED_reset] [get_bd_pins BRAM/sys_reset] [get_bd_pins Caches/sys_reset] \
  [get_bd_pins AHBlite_Control/sys_reset] [get_bd_pins mem_32_to_128/sys_reset] [get_bd_pins Encryption/sys_reset] \
  [get_bd_pins CACHE_AHB_MUX_0/rst_ni] [get_bd_pins clk_wiz_0/resetn] [get_bd_pins AHB2DUMP_0/HRESETn] \
  [get_bd_pins RISCV_CORE/rst_ni] [get_bd_pins AHB2TIMER_0/HRESETn] [get_bd_pins AHB2UART_0/HRESETn]
connect_bd_net -net riscv_top_ahb3lite_0_dat_HADDR [get_bd_pins CACHE_AHB_MUX_0/dat_HADDR] \
  [get_bd_pins BRAM/HADDR] [get_bd_pins AHBlite_Control/HADDR] [get_bd_pins Encryption/HADDR] [get_bd_pins AHB2DUMP_0/HADDR] \
  [get_bd_pins AHB2TIMER_0/HADDR] [get_bd_pins AHB2UART_0/HADDR]
connect_bd_net -net riscv_top_ahb3lite_0_dat_HTRANS [get_bd_pins CACHE_AHB_MUX_0/dat_HTRANS] \
  [get_bd_pins BRAM/HTRANS] [get_bd_pins Encryption/HTRANS] [get_bd_pins AHB2DUMP_0/HTRANS] [get_bd_pins AHB2TIMER_0/HTRANS] \
  [get_bd_pins AHB2UART_0/HTRANS]
connect_bd_net -net riscv_top_ahb3lite_0_dat_HWDATA [get_bd_pins CACHE_AHB_MUX_0/dat_HWDATA] \
  [get_bd_pins BRAM/HWDATA] [get_bd_pins Encryption/HWDATA] [get_bd_pins AHB2DUMP_0/HWDATA] [get_bd_pins AHB2TIMER_0/HWDATA] \
  [get_bd_pins AHB2UART_0/HWDATA]
connect_bd_net -net riscv_top_ahb3lite_0_dat_HWRITE [get_bd_pins CACHE_AHB_MUX_0/dat_HWRITE] \
  [get_bd_pins BRAM/HWRITE] [get_bd_pins Encryption/HWRITE] [get_bd_pins AHB2DUMP_0/HWRITE] [get_bd_pins AHB2TIMER_0/HWRITE] \
  [get_bd_pins AHB2UART_0/HWRITE]
connect_bd_net [get_bd_ports sysclk_n] [get_bd_pins clk_wiz_0/clk_in1_n]
connect_bd_net [get_bd_ports sysclk_p] [get_bd_pins clk_wiz_0/clk_in1_p]
connect_bd_net -net xlconcat_0_dout [get_bd_pins irqs/dout] [get_bd_pins RISCV_CORE/irq_i]
connect_bd_net [get_bd_pins xlconstant_0/dout] [get_bd_pins AHB2DUMP_0/GPIO_INPUTS_10_8]
connect_bd_net -net xlconstant_10_dout [get_bd_pins high/dout] \
  [get_bd_pins CACHE_AHB_MUX_0/dat_HRESP] [get_bd_pins RISCV_CORE/fetch_enable_i] [get_bd_pins RISCV_CORE/fencei_flush_ack_i]
connect_bd_net -net xlconstant_4_dout [get_bd_pins low/dout] \
  [get_bd_pins Caches/inst_cpu_req] [get_bd_pins RISCV_CORE/scan_cg_en_i] [get_bd_pins RISCV_CORE/wu_wfe_i]
connect_bd_net [get_bd_pins xlconstant_9/dout] [get_bd_pins AHB2UART_0/RsRx]
connect_bd_net [get_bd_pins xlslice_0/Dout] [get_bd_ports OUTPUT_LEDs]

validate_bd_design
save_bd_design
